# Altium schematic sheet 07-AD9546_Outputs.SchDoc
size A; SheetNumber: 7; SheetTotal: 16
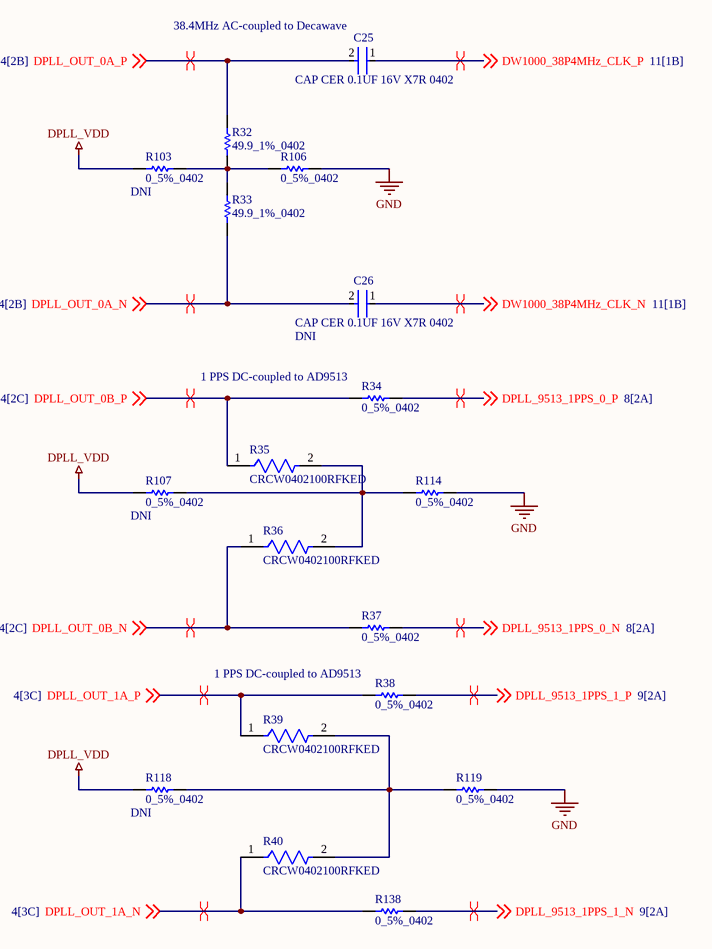
[diagram p0: 07-AD9546_Outputs.SchDoc]

## Parts
C25  GRM155R71C104KA88D  [FP-GRM15-MFG]  (value not drawn)
C26  GRM155R71C104KA88D  [FP-GRM15-MFG]  (value not drawn)  (no BOM)
R32  49.9_1%_0402  [RESC1005X40X25NL05T05]
R33  49.9_1%_0402  [RESC1005X40X25NL05T05]
R34  0_5%_0402  [RESC1005X40X25LL10T10]
R35  CRCW0402100RFKED  [FP-CRCW0402-e3-IPC_C]
R36  CRCW0402100RFKED  [FP-CRCW0402-e3-IPC_C]
R37  0_5%_0402  [RESC1005X40X25LL10T10]
R38  0_5%_0402  [RESC1005X40X25LL10T10]
R39  CRCW0402100RFKED  [FP-CRCW0402-e3-IPC_C]
R40  CRCW0402100RFKED  [FP-CRCW0402-e3-IPC_C]
R103  0_5%_0402  [RESC1005X40X25LL10T10]  (no BOM)
R106  0_5%_0402  [RESC1005X40X25LL10T10]
R107  0_5%_0402  [RESC1005X40X25LL10T10]  (no BOM)
R114  0_5%_0402  [RESC1005X40X25LL10T10]
R118  0_5%_0402  [RESC1005X40X25LL10T10]  (no BOM)
R119  0_5%_0402  [RESC1005X40X25LL10T10]
R138  0_5%_0402  [RESC1005X40X25LL10T10]

## Nets
DPLL_VDD: R103.1 R107.1 R118.1
GND: R106.2 R114.2 R119.2
DPLL_9513_1PPS_0_N: R37.2 ; off-sheet DPLL_9513_1PPS_0_N
DPLL_9513_1PPS_0_P: R34.2 ; off-sheet DPLL_9513_1PPS_0_P
DPLL_9513_1PPS_1_N: R138.2 ; off-sheet DPLL_9513_1PPS_1_N
DPLL_9513_1PPS_1_P: R38.2 ; off-sheet DPLL_9513_1PPS_1_P
DPLL_OUT_0A_N: C26.2 R33.1 ; off-sheet DPLL_OUT_0A_N
DPLL_OUT_0A_P: C25.2 R32.2 ; off-sheet DPLL_OUT_0A_P
DPLL_OUT_0B_N: R36.1 R37.1 ; off-sheet DPLL_OUT_0B_N
DPLL_OUT_0B_P: R34.1 R35.1 ; off-sheet DPLL_OUT_0B_P
DPLL_OUT_1A_N: R40.1 R138.1 ; off-sheet DPLL_OUT_1A_N
DPLL_OUT_1A_P: R38.1 R39.1 ; off-sheet DPLL_OUT_1A_P
DW1000_38P4MHz_CLK_N: C26.1 ; off-sheet DW1000_38P4MHz_CLK_N
DW1000_38P4MHz_CLK_P: C25.1 ; off-sheet DW1000_38P4MHz_CLK_P
NetR32_1: R32.1 R33.2 R103.2 R106.1
NetR35_2: R35.2 R36.2 R107.2 R114.1
NetR39_2: R39.2 R40.2 R118.2 R119.1

## Layout directives
differential pair; differential pair class 100ohm: DPLL_9513_1PPS_0_N, DPLL_9513_1PPS_0_P, DPLL_9513_1PPS_1_N, DPLL_9513_1PPS_1_P, DPLL_OUT_0A_N, DPLL_OUT_0A_P, DPLL_OUT_0B_N, DPLL_OUT_0B_P, DPLL_OUT_1A_N, DPLL_OUT_1A_P, DW1000_38P4MHz_CLK_N, DW1000_38P4MHz_CLK_P

## Notes on the sheet
- (near C25) 38.4MHz AC-coupled to Decawave
- (near R34) 1 PPS DC-coupled to AD9513
- (near R38) 1 PPS DC-coupled to AD9513

## Library data of the parts
C25 C26 = CMP-2100-03641-2: CAP CER 0.1UF 16V X7R 0402; Manufacturer: Murata; Standoff Height: 0mm; Tolerance: 10%; Voltage Rating: 16Vdc; Material: Ceramic; Capacitance: 0.10μF; Value: 0.10μF; RoHS: TRUE; Manufacturer Part Number: GRM155R71C104KA88D; Temperature Characteristic: X7R; Octopart: https://octopart.com/grm155r71c104ka88d-murata-196880; Digikey Description: CAP CER 0.1UF 16V X7R 0402; Device Class L3: Ceramic Capacitors; Height: 0.55mm; ComponentLink2Description: Datasheet; Temperature Range Low: -55°C; Ipc Land Pattern Name: CAPC10050X219; ComponentLink2URL: https://search.murata.co.jp/Ceramy/image/img/A01X/G101/ENG/GRM155R71H471KA01-01A.pdf; Device Class L1: Passive Components; Lead Free: yes; Category: Cap; Package: GRM15; Temperature: -55°C to +125°C; Device Class L2: Capacitors; Temperature Range High: +125°C; Mouser Description: 0402 0.1 uF 16V ±10 % Tolerance X7R SMT Multilayer Ceramic Capacitor
  C26: DNI: DNI
R32 R33 = CMP-2002-00969-1: Manufacturer: Panasonic; Part Number: ERJ-2RKF49R9X
R34 R37 R38 R103 R106 R107 R114 R118 R119 R138 = CMP-2002-04569-1: Manufacturer: KOA Speer; Part Number: RK73Z1ETTP
  R103 R107 R118: DNI: DNI
R35 R36 R39 R40 = CMP-1011-00397-3: RES Thick Film, 100Ω, 1%, 0.063W, 100ppm/°C, 0402; Max Power Dissipation: 63mW; Voltage Rating: 50V; Resistance: 100R; Package Quantity: 10; Lead Free: Lead Free; Termination: SMD/SMT; Case Code (Metric): 1005; Number of Terminations: 2; Composition: Thick Film; Voltage Rating (DC): 50V; Min Operating Temperature: -55°C; Case/Package: 0402; Radiation Hardening: No; Max Operating Temperature: 155°C; Temperature Coefficient: 100ppm/°C; Military Standard: Not; Length: 1mm; Mount: Surface Mount; Power Rating: 63mW; Weight: 2.3E-05oz; Working Voltage: 50V; Features: Automotive AEC-Q200; Depth: 0.5mm; Packaging: Tape and Reel; Tolerance: 1%; Height: 0.35mm; Case Code (Imperial): 0402; Width: 0.02inch; Contact Plating: Tin